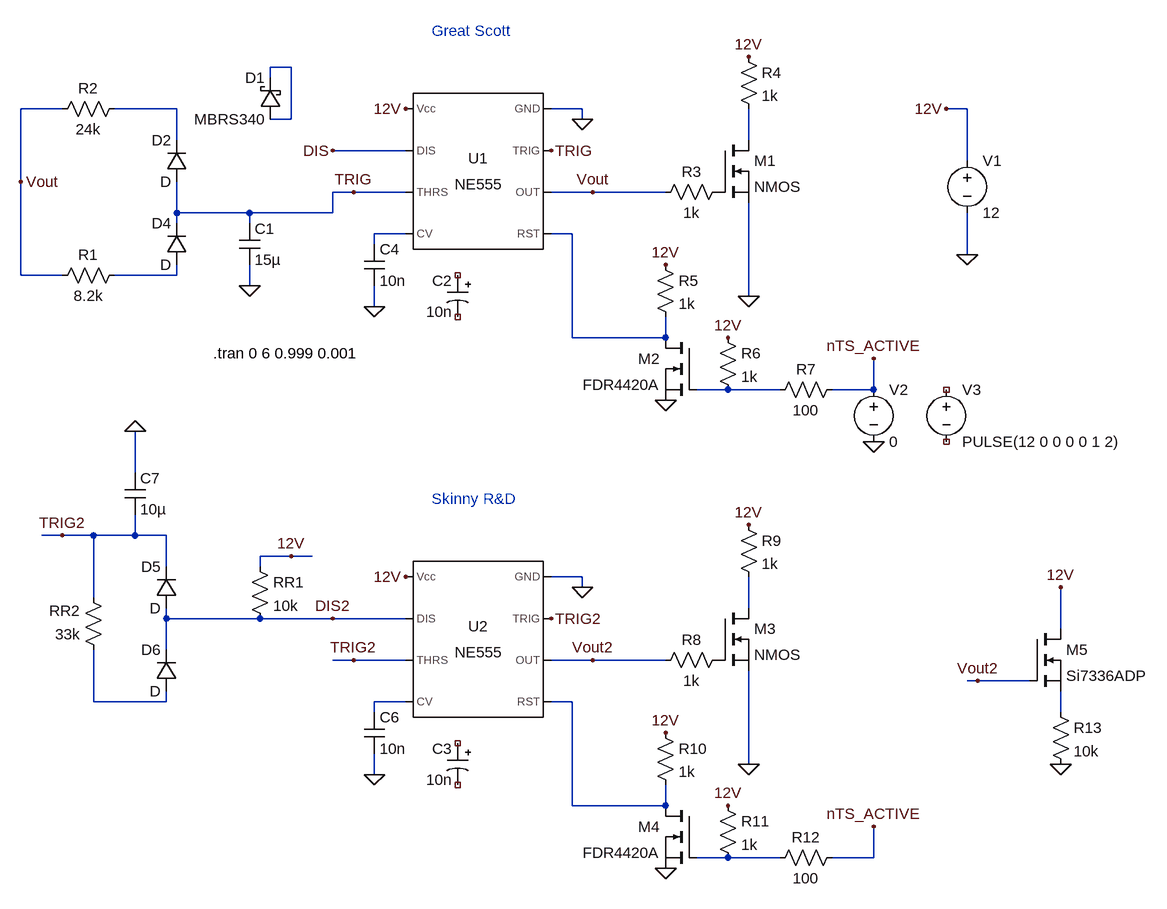
[diagram p0: schematic Timer Duty Cycle.asc]
Timer Duty Cycle.asc, the LTspice schematic file:
Version 4
SHEET 1 1016 1380
WIRE -560 64 -592 64
WIRE -592 80 -592 64
WIRE -912 128 -976 128
WIRE -736 128 -832 128
WIRE -112 128 -160 128
WIRE 480 128 448 128
WIRE -560 144 -560 64
WIRE -560 144 -592 144
WIRE -112 144 -112 128
WIRE -736 176 -736 128
WIRE 144 176 144 128
WIRE -384 192 -496 192
WIRE 480 208 480 128
WIRE -976 240 -976 128
WIRE -464 256 -496 256
WIRE -384 256 -464 256
WIRE -96 256 -160 256
WIRE 16 256 -96 256
WIRE -736 288 -736 240
WIRE -624 288 -736 288
WIRE -496 288 -496 256
WIRE -496 288 -624 288
WIRE -736 304 -736 288
WIRE -624 304 -624 288
WIRE -384 320 -432 320
WIRE -128 320 -160 320
WIRE -432 336 -432 320
WIRE 480 352 480 288
WIRE -976 384 -976 240
WIRE -912 384 -976 384
WIRE -736 384 -736 368
WIRE -736 384 -832 384
WIRE -624 400 -624 368
WIRE 144 416 144 272
WIRE -432 432 -432 400
WIRE -128 480 -128 320
WIRE 16 480 16 448
WIRE 16 480 -128 480
WIRE 112 560 64 560
WIRE 192 560 112 560
WIRE 336 560 336 512
WIRE 336 560 272 560
WIRE -800 688 -800 624
WIRE -912 784 -944 784
WIRE -864 784 -912 784
WIRE -800 784 -800 752
WIRE -800 784 -864 784
WIRE -752 784 -800 784
WIRE -560 816 -608 816
WIRE -528 816 -560 816
WIRE -752 832 -752 784
WIRE -608 832 -608 816
WIRE -112 848 -160 848
WIRE -112 864 -112 848
WIRE -864 880 -864 784
WIRE 144 896 144 848
WIRE -752 912 -752 896
WIRE -608 912 -752 912
WIRE -496 912 -608 912
WIRE -384 912 -496 912
WIRE 624 928 624 864
WIRE -752 960 -752 912
WIRE -464 976 -496 976
WIRE -384 976 -464 976
WIRE -96 976 -160 976
WIRE 16 976 -96 976
WIRE 496 1008 480 1008
WIRE 576 1008 496 1008
WIRE -864 1040 -864 960
WIRE -752 1040 -752 1024
WIRE -752 1040 -864 1040
WIRE -384 1040 -432 1040
WIRE -128 1040 -160 1040
WIRE -432 1056 -432 1040
WIRE 624 1056 624 1024
WIRE 144 1136 144 992
WIRE -432 1152 -432 1120
WIRE -128 1200 -128 1040
WIRE 16 1200 16 1168
WIRE 16 1200 -128 1200
WIRE 112 1280 64 1280
WIRE 192 1280 112 1280
WIRE 336 1280 336 1232
WIRE 336 1280 272 1280
FLAG 480 352 0
FLAG -112 144 0
FLAG -624 400 0
FLAG -384 128 12V
FLAG -432 432 0
FLAG -496 192 DIS
FLAG -160 192 TRIG
FLAG -96 256 Vout
FLAG 144 48 12V
FLAG 144 416 0
FLAG 16 368 12V
FLAG 16 576 0
FLAG 112 480 12V
FLAG 336 640 0
FLAG 336 512 nTS_ACTIVE
FLAG -464 256 TRIG
FLAG -976 240 Vout
FLAG 448 128 12V
FLAG -112 864 0
FLAG -384 848 12V
FLAG -432 1152 0
FLAG -496 912 DIS2
FLAG -160 912 TRIG2
FLAG -96 976 Vout2
FLAG 144 768 12V
FLAG 144 1136 0
FLAG 16 1088 12V
FLAG 16 1296 0
FLAG 112 1200 12V
FLAG 336 1232 nTS_ACTIVE
FLAG -464 976 TRIG2
FLAG -800 624 0
FLAG -912 784 TRIG2
FLAG -560 816 12V
FLAG 624 864 12V
FLAG 496 1008 Vout2
FLAG 624 1136 0
SYMBOL Misc\\NE555 -272 224 M0
SYMATTR InstName U1
SYMBOL voltage 480 192 R0
WINDOW 123 0 0 Left 2
WINDOW 39 0 0 Left 2
SYMATTR InstName V1
SYMATTR Value 12
SYMBOL polcap -288 384 M0
SYMATTR InstName C2
SYMATTR Value 10n
SYMBOL res 112 240 R90
WINDOW 0 0 56 VBottom 2
WINDOW 3 32 56 VTop 2
SYMATTR InstName R3
SYMATTR Value 1k
SYMBOL nmos 96 176 R0
SYMATTR InstName M1
SYMBOL res 128 32 R0
SYMATTR InstName R4
SYMATTR Value 1k
SYMBOL nmos 64 480 M0
SYMATTR InstName M2
SYMATTR Value FDR4420A
SYMBOL res 0 352 R0
SYMATTR InstName R5
SYMATTR Value 1k
SYMBOL res 96 464 R0
SYMATTR InstName R6
SYMATTR Value 1k
SYMBOL res 288 544 R90
WINDOW 0 0 56 VBottom 2
WINDOW 3 32 56 VTop 2
SYMATTR InstName R7
SYMATTR Value 100
SYMBOL voltage 448 544 R0
WINDOW 123 0 0 Left 2
WINDOW 39 0 0 Left 2
SYMATTR InstName V3
SYMATTR Value PULSE(12 0 0 0 0 1 2)
SYMBOL res -816 368 R90
WINDOW 0 0 56 VBottom 2
WINDOW 3 32 56 VTop 2
SYMATTR InstName R1
SYMATTR Value 8.2k
SYMBOL res -816 112 R90
WINDOW 0 0 56 VBottom 2
WINDOW 3 32 56 VTop 2
SYMATTR InstName R2
SYMATTR Value 24k
SYMBOL cap -640 304 R0
SYMATTR InstName C1
SYMATTR Value 15µ
SYMBOL cap -448 336 R0
SYMATTR InstName C4
SYMATTR Value 10n
SYMBOL voltage 336 544 R0
WINDOW 123 0 0 Left 2
WINDOW 39 0 0 Left 2
SYMATTR InstName V2
SYMATTR Value 0
SYMBOL schottky -576 144 R180
WINDOW 0 24 64 Left 2
WINDOW 3 24 0 Left 2
SYMATTR InstName D1
SYMATTR Value MBRS340
SYMATTR Description Diode
SYMATTR Type diode
SYMBOL diode -720 240 R180
WINDOW 0 24 64 Left 2
WINDOW 3 24 0 Left 2
SYMATTR InstName D2
SYMBOL diode -720 368 R180
WINDOW 0 24 64 Left 2
WINDOW 3 24 0 Left 2
SYMATTR InstName D4
SYMBOL Misc\\NE555 -272 944 M0
SYMATTR InstName U2
SYMBOL polcap -288 1104 M0
SYMATTR InstName C3
SYMATTR Value 10n
SYMBOL res 112 960 R90
WINDOW 0 0 56 VBottom 2
WINDOW 3 32 56 VTop 2
SYMATTR InstName R8
SYMATTR Value 1k
SYMBOL nmos 96 896 R0
SYMATTR InstName M3
SYMBOL res 128 752 R0
SYMATTR InstName R9
SYMATTR Value 1k
SYMBOL nmos 64 1200 M0
SYMATTR InstName M4
SYMATTR Value FDR4420A
SYMBOL res 0 1072 R0
SYMATTR InstName R10
SYMATTR Value 1k
SYMBOL res 96 1184 R0
SYMATTR InstName R11
SYMATTR Value 1k
SYMBOL res 288 1264 R90
WINDOW 0 0 56 VBottom 2
WINDOW 3 32 56 VTop 2
SYMATTR InstName R12
SYMATTR Value 100
SYMBOL cap -448 1056 R0
SYMATTR InstName C6
SYMATTR Value 10n
SYMBOL diode -736 896 R180
WINDOW 0 24 64 Left 2
WINDOW 3 24 0 Left 2
SYMATTR InstName D5
SYMBOL diode -736 1024 R180
WINDOW 0 24 64 Left 2
WINDOW 3 24 0 Left 2
SYMATTR InstName D6
SYMBOL res -848 976 R180
WINDOW 0 36 76 Left 2
WINDOW 3 36 40 Left 2
SYMATTR InstName RR2
SYMATTR Value 33k
SYMBOL cap -816 688 R0
SYMATTR InstName C7
SYMATTR Value 10µ
SYMBOL res -624 816 R0
SYMATTR InstName RR1
SYMATTR Value 10k
SYMBOL nmos 576 928 R0
SYMATTR InstName M5
SYMATTR Value Si7336ADP
SYMBOL res 608 1040 R0
SYMATTR InstName R13
SYMATTR Value 10k
TEXT -680 504 Left 2 !.tran 0 6 0.999 0.001
TEXT -344 8 Left 2 ;Great Scott
TEXT -344 728 Left 2 ;Skinny R&D

The netlist it stands for:
* Timer Duty Cycle.asc
XU1 0 TRIG Vout N005 N004 TRIG DIS 12V NE555  ; pins GND TRIG OUT RST CV THRS DIS Vcc
V1 12V 0 12
C2 NC_01 NC_02 10n
R3 P001 Vout 1k
M1 N003 P001 0 0 NMOS
R4 12V N003 1k
M2 N005 N007 0 0 FDR4420A
R5 12V N005 1k
R6 12V N007 1k
R7 nTS_ACTIVE N007 100
V3 NC_03 NC_04 PULSE(12 0 0 0 0 1 2)
R1 N006 Vout 8.2k
R2 N002 Vout 24k
C1 TRIG 0 15µ
C4 N004 0 10n
V2 nTS_ACTIVE 0 0
D1 N001 N001 MBRS340
D2 TRIG N002 D
D4 N006 TRIG D
XU2 0 TRIG2 Vout2 N011 N010 TRIG2 DIS2 12V NE555  ; pins GND TRIG OUT RST CV THRS DIS Vcc
C3 NC_05 NC_06 10n
R8 P002 Vout2 1k
M3 N008 P002 0 0 NMOS
R9 12V N008 1k
M4 N011 N013 0 0 FDR4420A
R10 12V N011 1k
R11 12V N013 1k
R12 nTS_ACTIVE N013 100
C6 N010 0 10n
D5 DIS2 TRIG2 D
D6 N009 DIS2 D
RR2 N009 TRIG2 33k
C7 0 TRIG2 10µ
RR1 12V DIS2 10k
M5 12V Vout2 N012 N012 Si7336ADP
R13 N012 0 10k
.model D D
.lib standard.dio
.model NMOS NMOS
.model PMOS PMOS
.lib standard.mos
.tran 0 6 0.999 0.001
* Great Scott
* Skinny R&D
.lib NE555.sub
.backanno
.end